# EAGLE schematic hpc_example (EAGLE 8.1.0)

## Sheet 1 of 2
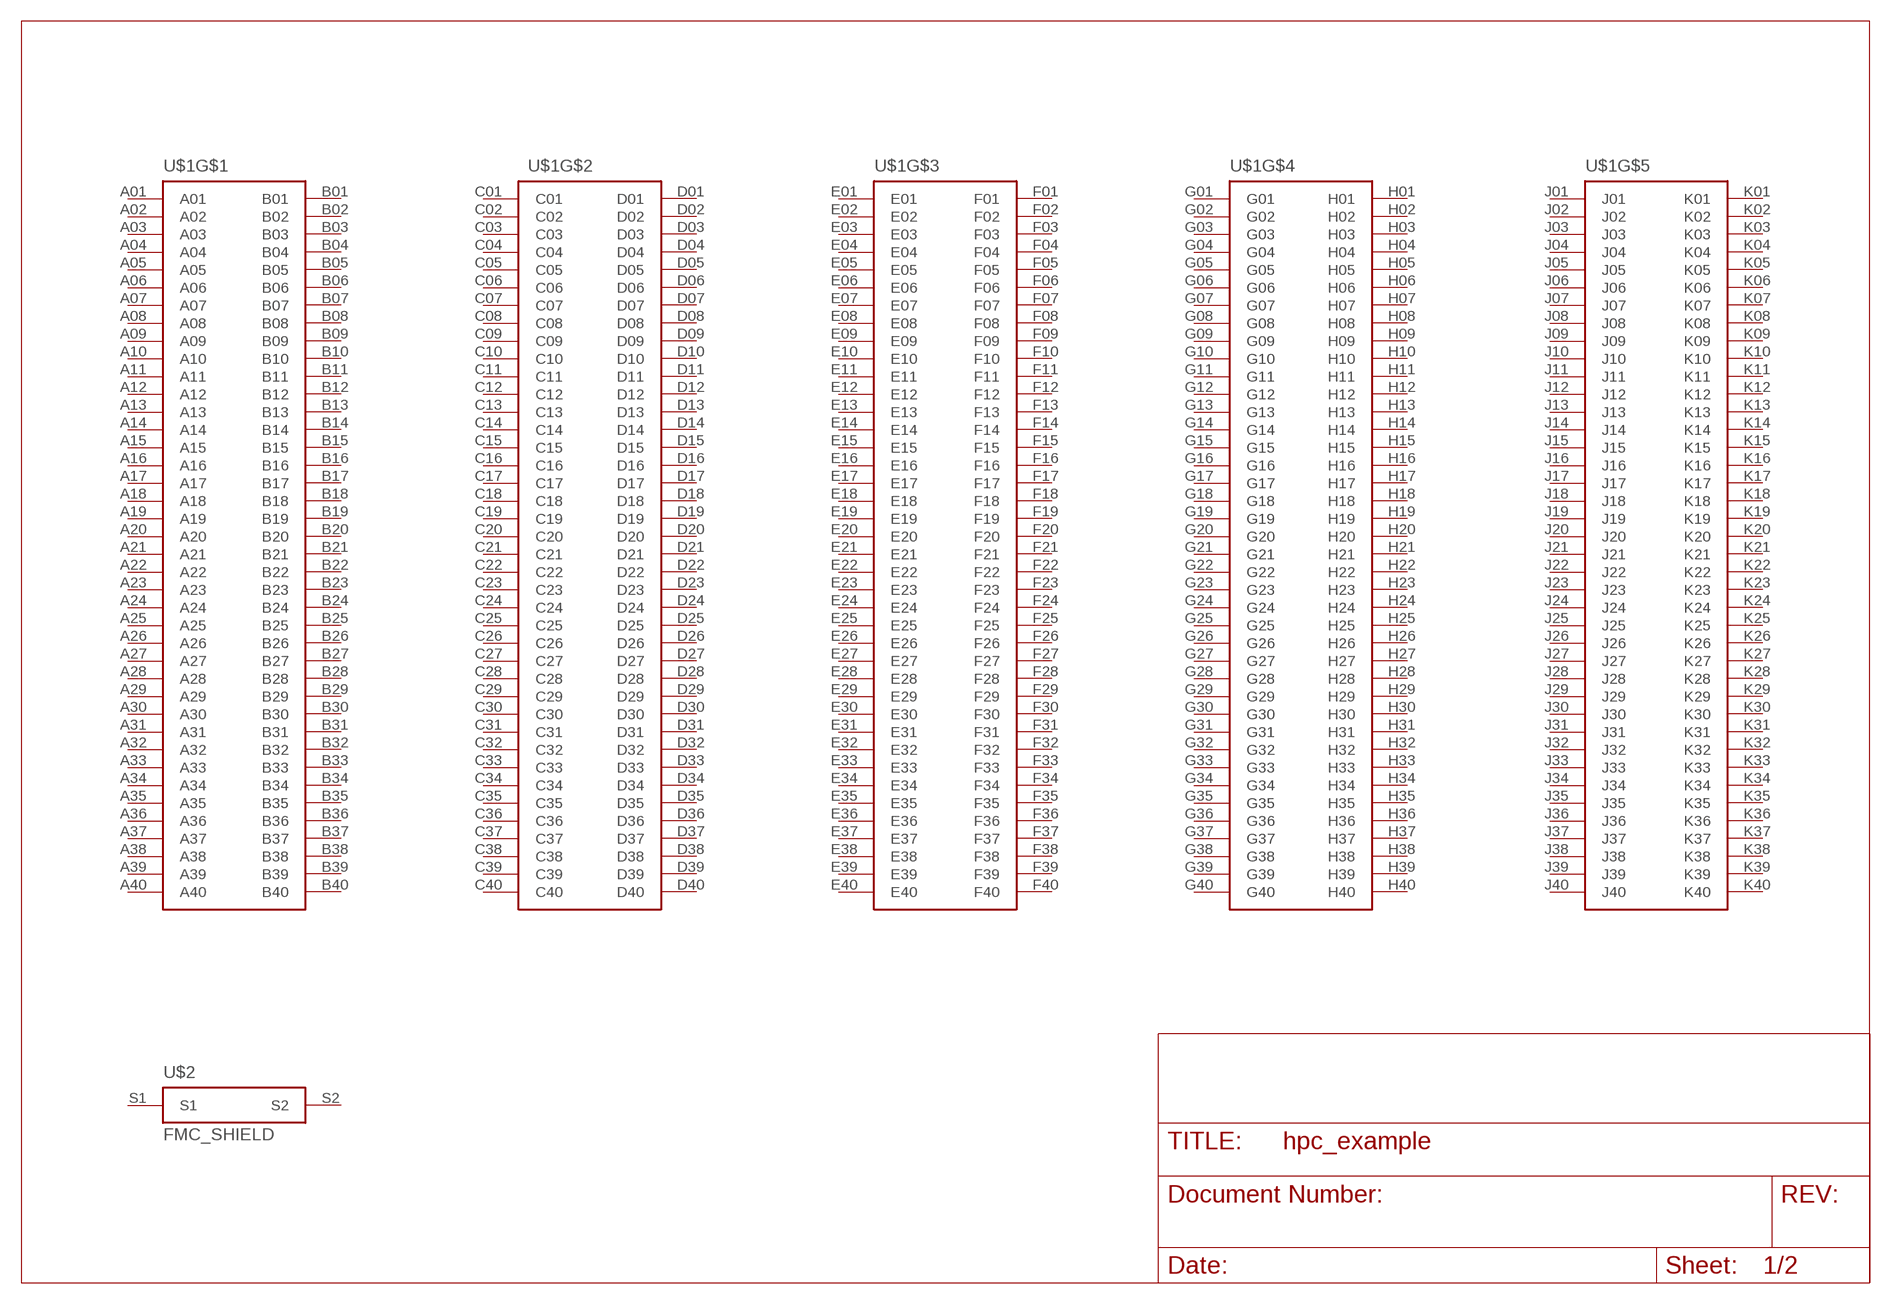
[diagram p0: schematic, sheet 1]

### Parts
U$1  APS_HPC_M  [ASP-134488-01]
U$2  XILINX_FMC_MOUNT_CS  [XILINX_FMC_MOUNT_CS]
Unconnected: U$1.A01 U$1.A02 U$1.A03 U$1.A04 U$1.A05 U$1.A06 U$1.A07 U$1.A08 U$1.A09 U$1.A10 U$1.A11 U$1.A12 U$1.A13 U$1.A14 U$1.A15 U$1.A16 U$1.A17 U$1.A18 U$1.A19 U$1.A20 U$1.A21 U$1.A22 U$1.A23 U$1.A24 U$1.A25 U$1.A26 U$1.A27 U$1.A28 U$1.A29 U$1.A30 U$1.A31 U$1.A32 U$1.A33 U$1.A34 U$1.A35 U$1.A36 U$1.A37 U$1.A38 U$1.A39 U$1.A40 U$1.B01 U$1.B02 U$1.B03 U$1.B04 U$1.B05 U$1.B06 U$1.B07 U$1.B08 U$1.B09 U$1.B10 U$1.B11 U$1.B12 U$1.B13 U$1.B14 U$1.B15 U$1.B16 U$1.B17 U$1.B18 U$1.B19 U$1.B20 U$1.B21 U$1.B22 U$1.B23 U$1.B24 U$1.B25 U$1.B26 U$1.B27 U$1.B28 U$1.B29 U$1.B30 U$1.B31 U$1.B32 U$1.B33 U$1.B34 U$1.B35 U$1.B36 U$1.B37 U$1.B38 U$1.B39 U$1.B40 U$1.C01 U$1.C02 U$1.C03 U$1.C04 U$1.C05 U$1.C06 U$1.C07 U$1.C08 U$1.C09 U$1.C10 U$1.C11 U$1.C12 U$1.C13 U$1.C14 U$1.C15 U$1.C16 U$1.C17 U$1.C18 U$1.C19 U$1.C20 U$1.C21 U$1.C22 U$1.C23 U$1.C24 U$1.C25 U$1.C26 U$1.C27 U$1.C28 U$1.C29 U$1.C30 U$1.C31 U$1.C32 U$1.C33 U$1.C34 U$1.C35 U$1.C36 U$1.C37 U$1.C38 U$1.C39 U$1.C40 U$1.D01 U$1.D02 U$1.D03 U$1.D04 U$1.D05 U$1.D06 U$1.D07 U$1.D08 U$1.D09 U$1.D10 U$1.D11 U$1.D12 U$1.D13 U$1.D14 U$1.D15 U$1.D16 U$1.D17 U$1.D18 U$1.D19 U$1.D20 U$1.D21 U$1.D22 U$1.D23 U$1.D24 U$1.D25 U$1.D26 U$1.D27 U$1.D28 U$1.D29 U$1.D30 U$1.D31 U$1.D32 U$1.D33 U$1.D34 U$1.D35 U$1.D36 U$1.D37 U$1.D38 U$1.D39 U$1.D40 U$1.E01 U$1.E02 U$1.E03 U$1.E04 U$1.E05 U$1.E06 U$1.E07 U$1.E08 U$1.E09 U$1.E10 U$1.E11 U$1.E12 U$1.E13 U$1.E14 U$1.E15 U$1.E16 U$1.E17 U$1.E18 U$1.E19 U$1.E20 U$1.E21 U$1.E22 U$1.E23 U$1.E24 U$1.E25 U$1.E26 U$1.E27 U$1.E28 U$1.E29 U$1.E30 U$1.E31 U$1.E32 U$1.E33 U$1.E34 U$1.E35 U$1.E36 U$1.E37 U$1.E38 U$1.E39 U$1.E40 U$1.F01 U$1.F02 U$1.F03 U$1.F04 U$1.F05 U$1.F06 U$1.F07 U$1.F08 U$1.F09 U$1.F10 U$1.F11 U$1.F12 U$1.F13 U$1.F14 U$1.F15 U$1.F16 U$1.F17 U$1.F18 U$1.F19 U$1.F20 U$1.F21 U$1.F22 U$1.F23 U$1.F24 U$1.F25 U$1.F26 U$1.F27 U$1.F28 U$1.F29 U$1.F30 U$1.F31 U$1.F32 U$1.F33 U$1.F34 U$1.F35 U$1.F36 U$1.F37 U$1.F38 U$1.F39 U$1.F40 U$1.G01 U$1.G02 U$1.G03 U$1.G04 U$1.G05 U$1.G06 U$1.G07 U$1.G08 U$1.G09 U$1.G10 U$1.G11 U$1.G12 U$1.G13 U$1.G14 U$1.G15 U$1.G16 U$1.G17 U$1.G18 U$1.G19 U$1.G20 U$1.G21 U$1.G22 U$1.G23 U$1.G24 U$1.G25 U$1.G26 U$1.G27 U$1.G28 U$1.G29 U$1.G30 U$1.G31 U$1.G32 U$1.G33 U$1.G34 U$1.G35 U$1.G36 U$1.G37 U$1.G38 U$1.G39 U$1.G40 U$1.H01 U$1.H02 U$1.H03 U$1.H04 U$1.H05 U$1.H06 U$1.H07 U$1.H08 U$1.H09 U$1.H10 U$1.H11 U$1.H12 U$1.H13 U$1.H14 U$1.H15 U$1.H16 U$1.H17 U$1.H18 U$1.H19 U$1.H20 U$1.H21 U$1.H22 U$1.H23 U$1.H24 U$1.H25 U$1.H26 U$1.H27 U$1.H28 U$1.H29 U$1.H30 U$1.H31 U$1.H32 U$1.H33 U$1.H34 U$1.H35 U$1.H36 U$1.H37 U$1.H38 U$1.H39 U$1.H40 U$1.J01 U$1.J02 U$1.J03 U$1.J04 U$1.J05 U$1.J06 U$1.J07 U$1.J08 U$1.J09 U$1.J10 U$1.J11 U$1.J12 U$1.J13 U$1.J14 U$1.J15 U$1.J16 U$1.J17 U$1.J18 U$1.J19 U$1.J20 U$1.J21 U$1.J22 U$1.J23 U$1.J24 U$1.J25 U$1.J26 U$1.J27 U$1.J28 U$1.J29 U$1.J30 U$1.J31 U$1.J32 U$1.J33 U$1.J34 U$1.J35 U$1.J36 U$1.J37 U$1.J38 U$1.J39 U$1.J40 U$1.K01 U$1.K02 U$1.K03 U$1.K04 U$1.K05 U$1.K06 U$1.K07 U$1.K08 U$1.K09 U$1.K10 U$1.K11 U$1.K12 U$1.K13 U$1.K14 U$1.K15 U$1.K16 U$1.K17 U$1.K18 U$1.K19 U$1.K20 U$1.K21 U$1.K22 U$1.K23 U$1.K24 U$1.K25 U$1.K26 U$1.K27 U$1.K28 U$1.K29 U$1.K30 U$1.K31 U$1.K32 U$1.K33 U$1.K34 U$1.K35 U$1.K36 U$1.K37 U$1.K38 U$1.K39 U$1.K40 U$2.S1 U$2.S2

## Sheet 2 of 2
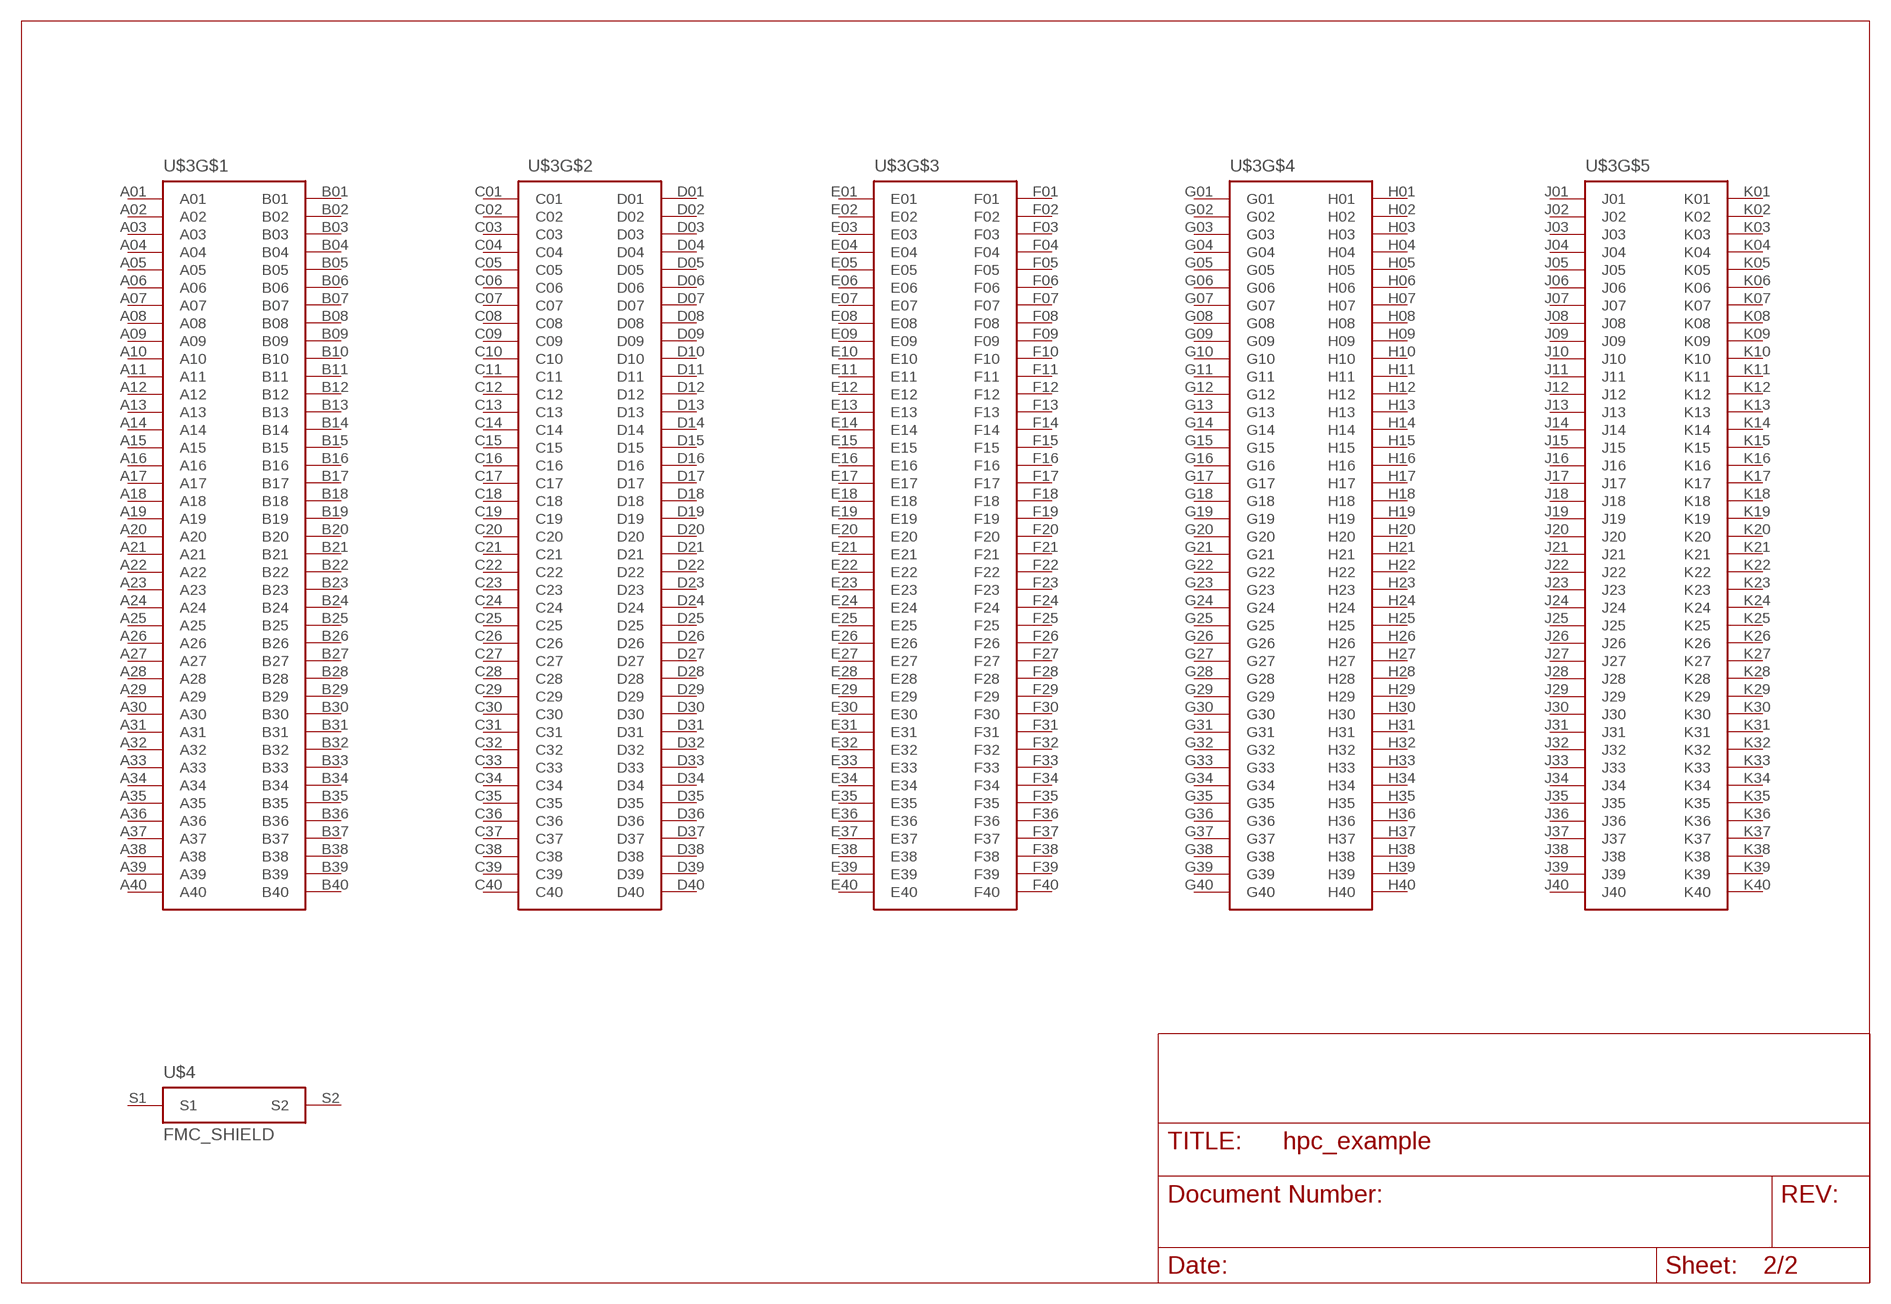
[diagram p1: schematic, sheet 2]

### Parts
U$3  APS_HPC_F  [ASP-134486-01]
U$4  XILINX_FMC_MOUNT_BS  [XILINX_FMC_MOUNT_BS]
Unconnected: U$3.A01 U$3.A02 U$3.A03 U$3.A04 U$3.A05 U$3.A06 U$3.A07 U$3.A08 U$3.A09 U$3.A10 U$3.A11 U$3.A12 U$3.A13 U$3.A14 U$3.A15 U$3.A16 U$3.A17 U$3.A18 U$3.A19 U$3.A20 U$3.A21 U$3.A22 U$3.A23 U$3.A24 U$3.A25 U$3.A26 U$3.A27 U$3.A28 U$3.A29 U$3.A30 U$3.A31 U$3.A32 U$3.A33 U$3.A34 U$3.A35 U$3.A36 U$3.A37 U$3.A38 U$3.A39 U$3.A40 U$3.B01 U$3.B02 U$3.B03 U$3.B04 U$3.B05 U$3.B06 U$3.B07 U$3.B08 U$3.B09 U$3.B10 U$3.B11 U$3.B12 U$3.B13 U$3.B14 U$3.B15 U$3.B16 U$3.B17 U$3.B18 U$3.B19 U$3.B20 U$3.B21 U$3.B22 U$3.B23 U$3.B24 U$3.B25 U$3.B26 U$3.B27 U$3.B28 U$3.B29 U$3.B30 U$3.B31 U$3.B32 U$3.B33 U$3.B34 U$3.B35 U$3.B36 U$3.B37 U$3.B38 U$3.B39 U$3.B40 U$3.C01 U$3.C02 U$3.C03 U$3.C04 U$3.C05 U$3.C06 U$3.C07 U$3.C08 U$3.C09 U$3.C10 U$3.C11 U$3.C12 U$3.C13 U$3.C14 U$3.C15 U$3.C16 U$3.C17 U$3.C18 U$3.C19 U$3.C20 U$3.C21 U$3.C22 U$3.C23 U$3.C24 U$3.C25 U$3.C26 U$3.C27 U$3.C28 U$3.C29 U$3.C30 U$3.C31 U$3.C32 U$3.C33 U$3.C34 U$3.C35 U$3.C36 U$3.C37 U$3.C38 U$3.C39 U$3.C40 U$3.D01 U$3.D02 U$3.D03 U$3.D04 U$3.D05 U$3.D06 U$3.D07 U$3.D08 U$3.D09 U$3.D10 U$3.D11 U$3.D12 U$3.D13 U$3.D14 U$3.D15 U$3.D16 U$3.D17 U$3.D18 U$3.D19 U$3.D20 U$3.D21 U$3.D22 U$3.D23 U$3.D24 U$3.D25 U$3.D26 U$3.D27 U$3.D28 U$3.D29 U$3.D30 U$3.D31 U$3.D32 U$3.D33 U$3.D34 U$3.D35 U$3.D36 U$3.D37 U$3.D38 U$3.D39 U$3.D40 U$3.E01 U$3.E02 U$3.E03 U$3.E04 U$3.E05 U$3.E06 U$3.E07 U$3.E08 U$3.E09 U$3.E10 U$3.E11 U$3.E12 U$3.E13 U$3.E14 U$3.E15 U$3.E16 U$3.E17 U$3.E18 U$3.E19 U$3.E20 U$3.E21 U$3.E22 U$3.E23 U$3.E24 U$3.E25 U$3.E26 U$3.E27 U$3.E28 U$3.E29 U$3.E30 U$3.E31 U$3.E32 U$3.E33 U$3.E34 U$3.E35 U$3.E36 U$3.E37 U$3.E38 U$3.E39 U$3.E40 U$3.F01 U$3.F02 U$3.F03 U$3.F04 U$3.F05 U$3.F06 U$3.F07 U$3.F08 U$3.F09 U$3.F10 U$3.F11 U$3.F12 U$3.F13 U$3.F14 U$3.F15 U$3.F16 U$3.F17 U$3.F18 U$3.F19 U$3.F20 U$3.F21 U$3.F22 U$3.F23 U$3.F24 U$3.F25 U$3.F26 U$3.F27 U$3.F28 U$3.F29 U$3.F30 U$3.F31 U$3.F32 U$3.F33 U$3.F34 U$3.F35 U$3.F36 U$3.F37 U$3.F38 U$3.F39 U$3.F40 U$3.G01 U$3.G02 U$3.G03 U$3.G04 U$3.G05 U$3.G06 U$3.G07 U$3.G08 U$3.G09 U$3.G10 U$3.G11 U$3.G12 U$3.G13 U$3.G14 U$3.G15 U$3.G16 U$3.G17 U$3.G18 U$3.G19 U$3.G20 U$3.G21 U$3.G22 U$3.G23 U$3.G24 U$3.G25 U$3.G26 U$3.G27 U$3.G28 U$3.G29 U$3.G30 U$3.G31 U$3.G32 U$3.G33 U$3.G34 U$3.G35 U$3.G36 U$3.G37 U$3.G38 U$3.G39 U$3.G40 U$3.H01 U$3.H02 U$3.H03 U$3.H04 U$3.H05 U$3.H06 U$3.H07 U$3.H08 U$3.H09 U$3.H10 U$3.H11 U$3.H12 U$3.H13 U$3.H14 U$3.H15 U$3.H16 U$3.H17 U$3.H18 U$3.H19 U$3.H20 U$3.H21 U$3.H22 U$3.H23 U$3.H24 U$3.H25 U$3.H26 U$3.H27 U$3.H28 U$3.H29 U$3.H30 U$3.H31 U$3.H32 U$3.H33 U$3.H34 U$3.H35 U$3.H36 U$3.H37 U$3.H38 U$3.H39 U$3.H40 U$3.J01 U$3.J02 U$3.J03 U$3.J04 U$3.J05 U$3.J06 U$3.J07 U$3.J08 U$3.J09 U$3.J10 U$3.J11 U$3.J12 U$3.J13 U$3.J14 U$3.J15 U$3.J16 U$3.J17 U$3.J18 U$3.J19 U$3.J20 U$3.J21 U$3.J22 U$3.J23 U$3.J24 U$3.J25 U$3.J26 U$3.J27 U$3.J28 U$3.J29 U$3.J30 U$3.J31 U$3.J32 U$3.J33 U$3.J34 U$3.J35 U$3.J36 U$3.J37 U$3.J38 U$3.J39 U$3.J40 U$3.K01 U$3.K02 U$3.K03 U$3.K04 U$3.K05 U$3.K06 U$3.K07 U$3.K08 U$3.K09 U$3.K10 U$3.K11 U$3.K12 U$3.K13 U$3.K14 U$3.K15 U$3.K16 U$3.K17 U$3.K18 U$3.K19 U$3.K20 U$3.K21 U$3.K22 U$3.K23 U$3.K24 U$3.K25 U$3.K26 U$3.K27 U$3.K28 U$3.K29 U$3.K30 U$3.K31 U$3.K32 U$3.K33 U$3.K34 U$3.K35 U$3.K36 U$3.K37 U$3.K38 U$3.K39 U$3.K40 U$4.S1 U$4.S2

## Library data of the parts
U$1 = flipbit_fmc:APS_HPC_M
U$2 = flipbit_fmc:XILINX_FMC_MOUNT_CS
U$3 = flipbit_fmc:APS_HPC_F
U$4 = flipbit_fmc:XILINX_FMC_MOUNT_BS